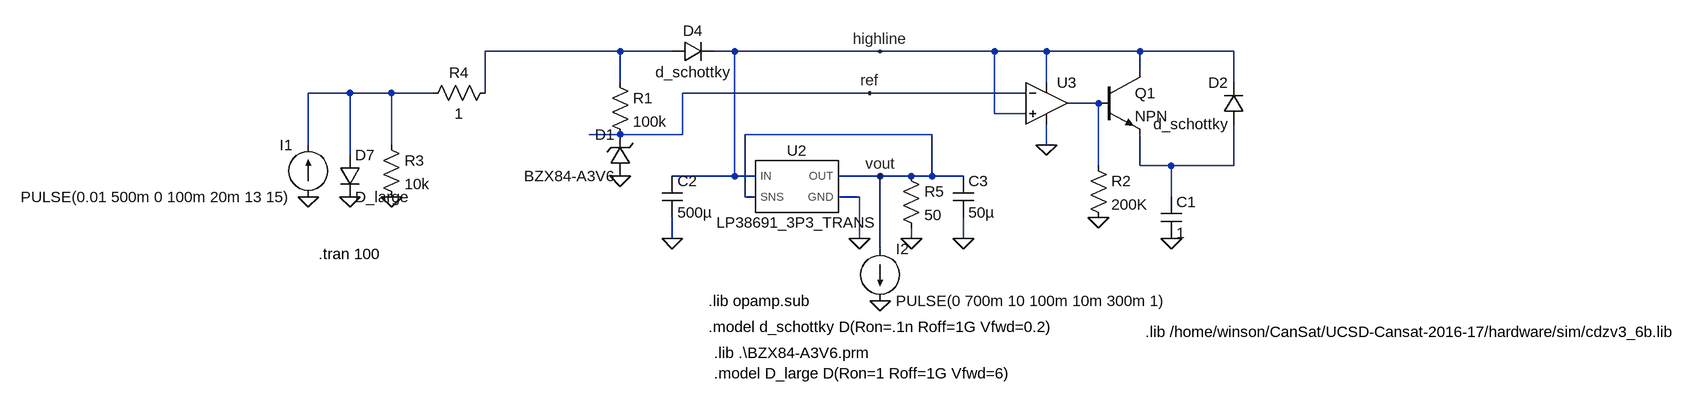
[diagram p0: schematic sim1.asc]
sim1.asc, the LTspice schematic file:
Version 4
SHEET 1 1684 680
WIRE -96 -16 -304 -16
WIRE -16 -16 -96 -16
WIRE 80 -16 48 -16
WIRE 304 -16 80 -16
WIRE 480 -16 304 -16
WIRE 560 -16 480 -16
WIRE 704 -16 560 -16
WIRE 848 -16 704 -16
WIRE 704 16 704 -16
WIRE -96 32 -96 -16
WIRE 560 32 560 -16
WIRE 848 32 848 -16
WIRE -512 48 -576 48
WIRE -448 48 -512 48
WIRE -384 48 -448 48
WIRE -304 48 -304 -16
WIRE 288 48 0 48
WIRE 528 48 288 48
WIRE 640 64 592 64
WIRE 480 80 480 -16
WIRE 528 80 480 80
WIRE -96 112 -144 112
WIRE 0 112 0 48
WIRE 0 112 -96 112
WIRE 384 112 96 112
WIRE -576 128 -576 48
WIRE -448 128 -448 48
WIRE 560 128 560 96
WIRE -512 144 -512 48
WIRE 640 160 640 64
WIRE 704 160 704 112
WIRE 752 160 704 160
WIRE 848 160 848 96
WIRE 848 160 752 160
WIRE 80 176 80 -16
WIRE 80 176 -16 176
WIRE 112 176 80 176
WIRE 304 176 240 176
WIRE 352 176 304 176
WIRE 384 176 384 112
WIRE 384 176 352 176
WIRE 432 176 384 176
WIRE 96 208 96 112
WIRE 112 208 96 208
WIRE 272 208 240 208
WIRE 752 208 752 160
WIRE -16 272 -16 240
WIRE 272 272 272 208
WIRE 352 272 352 256
WIRE 432 272 432 240
WIRE 304 288 304 176
FLAG -576 208 0
FLAG 752 272 0
FLAG -16 272 0
FLAG 432 272 0
FLAG 272 272 0
FLAG 640 240 0
FLAG -448 208 0
FLAG 560 128 0
FLAG 352 272 0
FLAG -512 208 0
FLAG 288 48 ref
FLAG 304 -16 highline
FLAG 304 176 vout
FLAG 304 368 0
FLAG -96 176 0
SYMBOL current -576 208 R180
WINDOW 0 24 80 Left 2
WINDOW 3 24 0 Left 2
WINDOW 123 0 0 Left 2
WINDOW 39 0 0 Left 2
SYMATTR InstName I1
SYMATTR Value PULSE(0.01 500m 0 100m 20m 13 15)
SYMBOL diode 864 96 R180
WINDOW 0 24 64 Left 2
WINDOW 3 24 0 Left 2
SYMATTR InstName D2
SYMATTR Value d_schottky
SYMBOL cap 736 208 R0
SYMATTR InstName C1
SYMATTR Value 1
SYMBOL cap -32 176 R0
SYMATTR InstName C2
SYMATTR Value 500µ
SYMBOL cap 416 176 R0
SYMATTR InstName C3
SYMATTR Value 50µ
SYMBOL LP38691_3P3_TRANS 176 192 R0
SYMATTR InstName U2
SYMBOL diode -16 0 R270
WINDOW 0 32 32 VTop 2
WINDOW 3 0 32 VBottom 2
SYMATTR InstName D4
SYMATTR Value d_schottky
SYMBOL res 624 144 R0
SYMATTR InstName R2
SYMATTR Value 200K
SYMBOL res -464 112 R0
SYMATTR InstName R3
SYMATTR Value 10k
SYMBOL res -288 32 R90
WINDOW 0 0 56 VBottom 2
WINDOW 3 32 56 VTop 2
SYMATTR InstName R4
SYMATTR Value 1
SYMBOL Opamps\\UniversalOpamp2 560 64 R0
SYMATTR InstName U3
SYMBOL res 336 160 R0
SYMATTR InstName R5
SYMATTR Value 50
SYMBOL diode -528 144 R0
SYMATTR InstName D7
SYMATTR Value D_large
SYMBOL npn 640 16 R0
SYMATTR InstName Q1
SYMBOL res -112 16 R0
SYMATTR InstName R1
SYMATTR Value 100k
SYMBOL current 304 288 R0
WINDOW 123 0 0 Left 2
WINDOW 39 0 0 Left 2
SYMATTR InstName I2
SYMATTR Value PULSE(0 700m 10 100m 10m 300m 1)
SYMBOL zener -80 176 R180
WINDOW 0 24 64 Left 2
WINDOW 3 24 0 Left 2
SYMATTR InstName D1
SYMATTR Value BZX84-A3V6
TEXT -560 296 Left 2 !.tran 100
TEXT 40 368 Left 2 !.lib opamp.sub
TEXT 40 408 Left 2 !.model d_schottky D(Ron=.1n Roff=1G Vfwd=0.2)
TEXT 48 448 Left 2 !.lib .\\BZX84-A3V6.prm
TEXT 48 480 Left 2 !.model D_large D(Ron=1 Roff=1G Vfwd=6)
TEXT 712 416 Left 2 !.lib /home/winson/CanSat/UCSD-Cansat-2016-17/hardware/sim/cdzv3_6b.lib

The netlist it stands for:
* sim1.asc
I1 0 N002 PULSE(0.01 500m 0 100m 20m 13 15)
D2 N004 highline d_schottky
C1 N004 0 1
C2 highline 0 500µ
C3 vout 0 50µ
XU2 highline vout vout 0 LP38691_3P3_TRANS  ; pins IN SNS OUT GND
D4 N001 highline d_schottky
R2 N003 0 200K
R3 N002 0 10k
R4 N001 N002 1
XU3 highline ref highline 0 N003 level.2 Avol=1Meg GBW=10Meg Slew=10Meg ilimit=25m rail=0 Vos=0 phimargin=45 en=0 enk=0 in=0 ink=0 Rin=500Meg  ; pins IN+ IN- V+ V- OUT
R5 vout 0 50
D7 N002 0 D_large
Q1 highline N003 N004 0 NPN
R1 N001 ref 100k
I2 vout 0 PULSE(0 700m 10 100m 10m 300m 1)
D1 0 ref BZX84-A3V6
.model D D
.lib standard.dio
.model NPN NPN
.model PNP PNP
.lib standard.bjt
.tran 100
.lib opamp.sub
.model d_schottky D(Ron=.1n Roff=1G Vfwd=0.2)
.lib .\BZX84-A3V6.prm
.model D_large D(Ron=1 Roff=1G Vfwd=6)
.lib /home/winson/CanSat/UCSD-Cansat-2016-17/hardware/sim/cdzv3_6b.lib
.lib Z:\home\winson\CanSat\UCSD-Cansat-2016-17\hardware\power\lib\lp38691_3p3_trans.lib
.lib UniversalOpamps2.sub
.backanno
.end